# Altium project UWB-NODE.PrjPcb
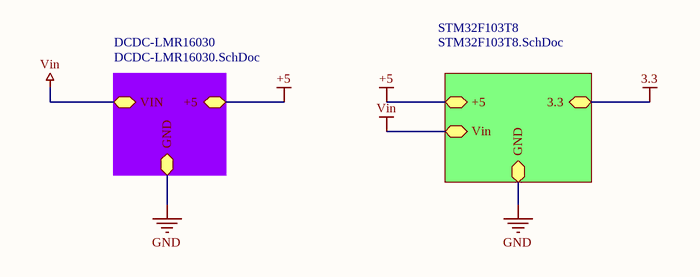
[diagram p0: UWB-NODE.SchDoc]
Quantity: 10
2 sheets, 32 parts. Net scope: hierarchical (ports join the sheet entries above them; power ports are global).
Board file: UWB-NODE.PcbDoc
Sheets:
  UWB-NODE.SchDoc
    STM32F103T8 = STM32F103T8.SchDoc

## Sheet UWB-NODE.SchDoc
size A; SheetNumber: 1; SheetTotal: 3

### Sub-sheets
DCDC-LMR16030 = DCDC-LMR16030.SchDoc (file not in this document): GND (bidir), VIN (bidir), +5 (bidir)
STM32F103T8 = STM32F103T8.SchDoc: GND (bidir), +5 (bidir), 3.3 (bidir), Vin (bidir)

### Nets
+5: sheet DCDC-LMR16030/+5, sheet STM32F103T8/+5
GND: sheet DCDC-LMR16030/GND, sheet STM32F103T8/GND
Vin: sheet DCDC-LMR16030/VIN, sheet STM32F103T8/Vin

## Sheet STM32F103T8.SchDoc
size A2; Revision: 10; SheetNumber: 3; SheetTotal: 3
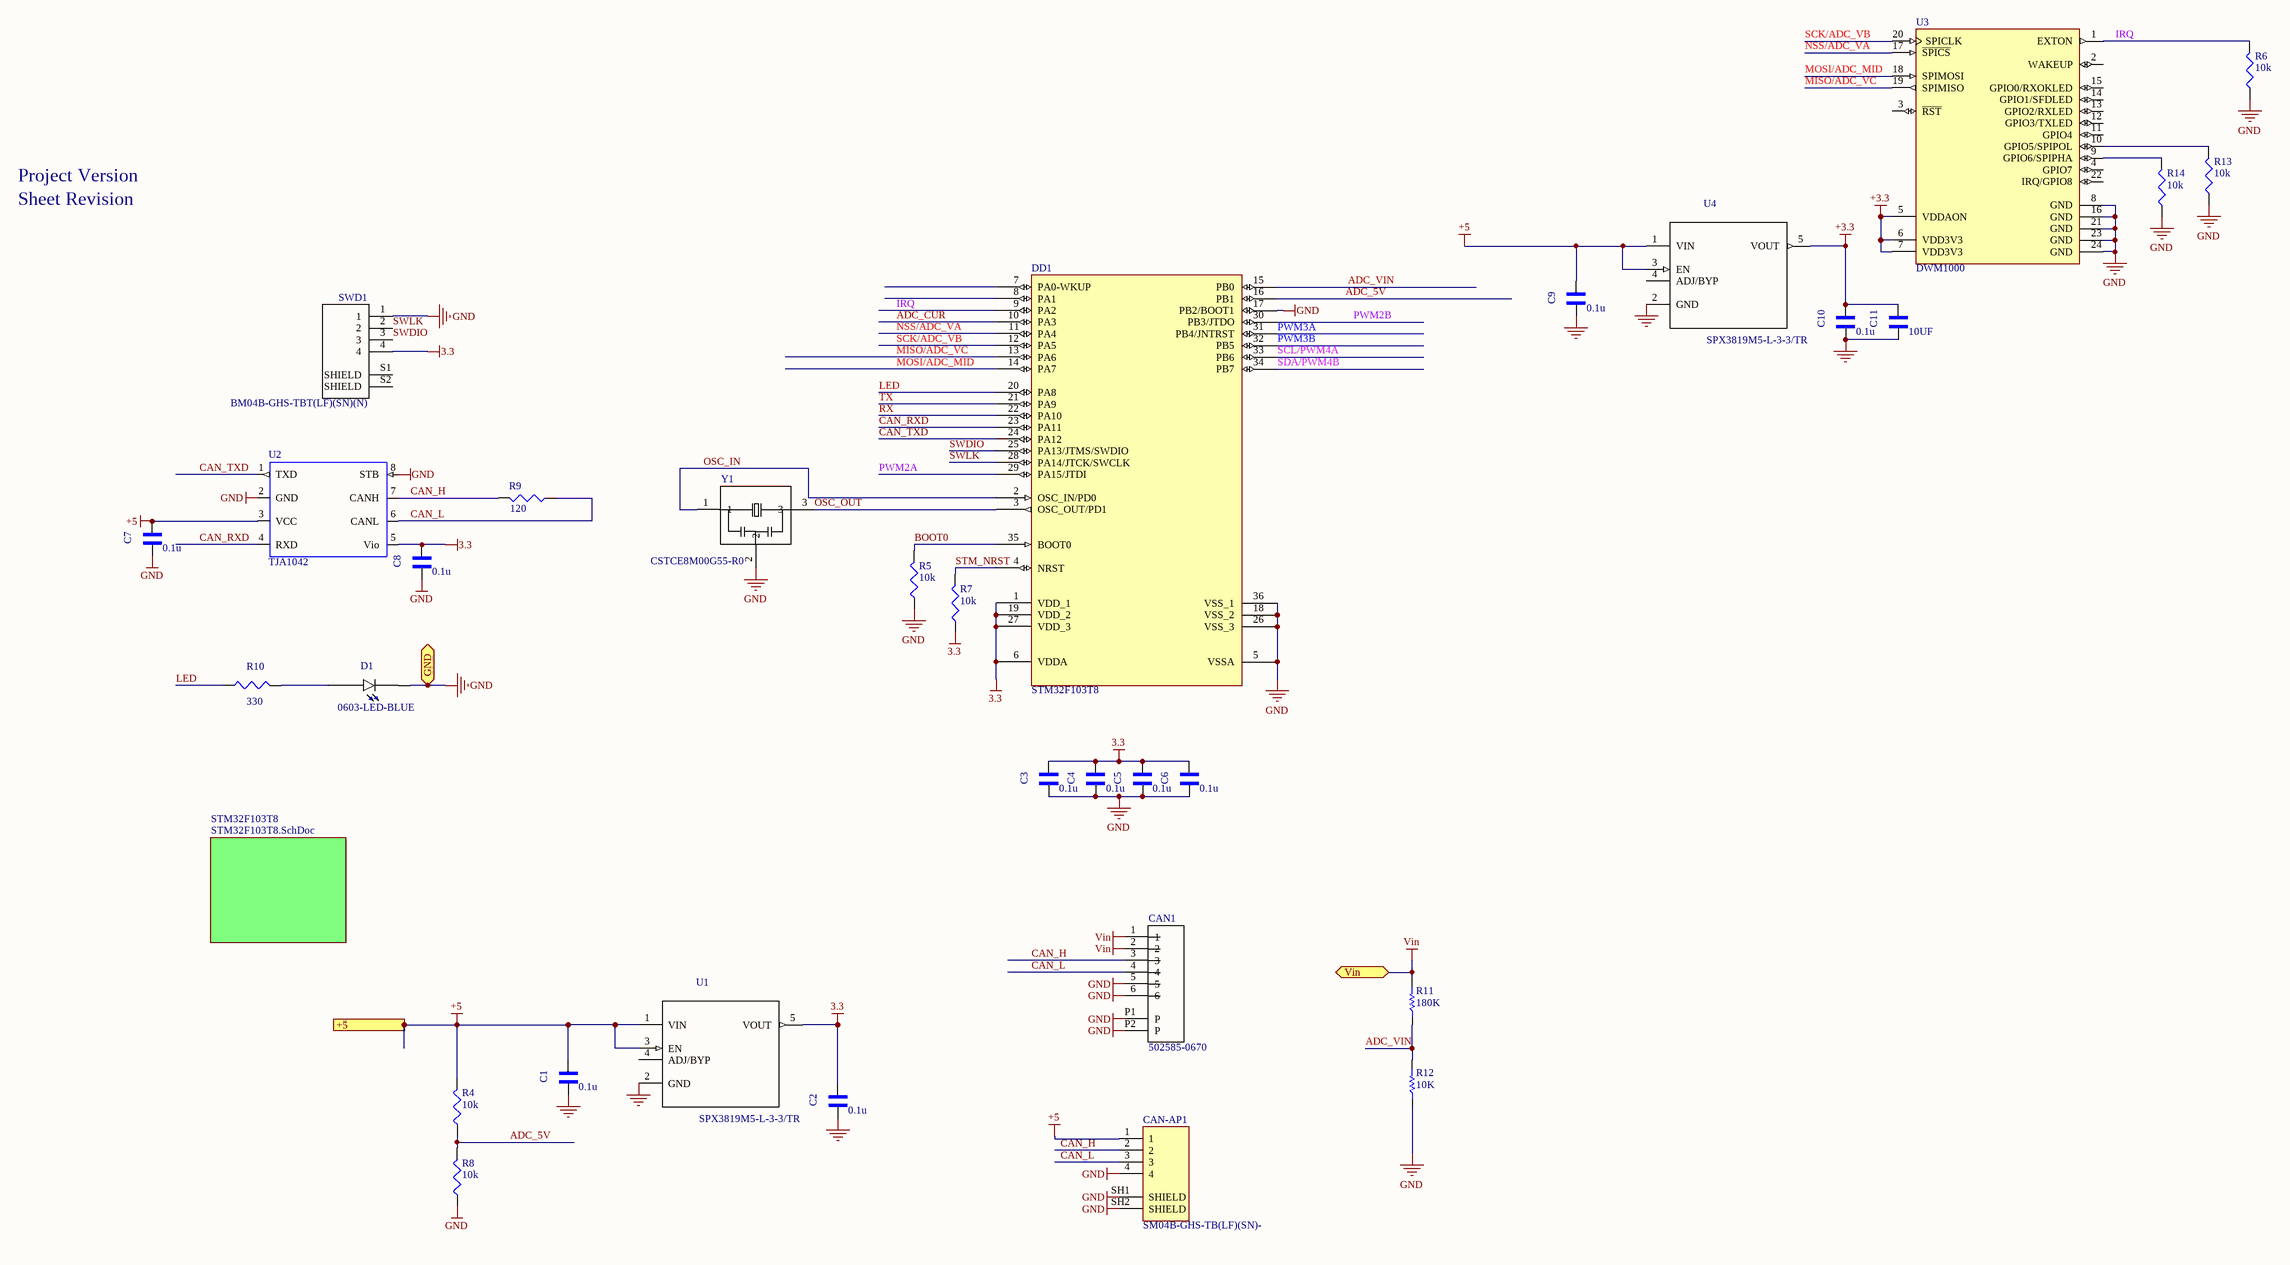
[diagram p1: STM32F103T8.SchDoc]

### Parts
C1  value 0.1u  [*CAPC1608X90]  (hidden comment: GX035C104MAT2-500)
C2  value 0.1u  [*CAPC1608X90]  (hidden comment: GX035C104MAT2-500)
C3  value 0.1u  [*CAPC1608X90]  (hidden comment: GX035C104MAT2-500)
C4  value 0.1u  [*CAPC1608X90]  (hidden comment: GX035C104MAT2-500)
C5  value 0.1u  [*CAPC1608X90]  (hidden comment: GX035C104MAT2-500)
C6  value 0.1u  [*CAPC1608X90]  (hidden comment: GX035C104MAT2-500)
C7  value 0.1u  [*CAPC1608X90]  (hidden comment: GX035C104MAT2-500)
C8  value 0.1u  [*CAPC1608X90]  (hidden comment: GX035C104MAT2-500)
C9  value 0.1u  [*CAPC1608X90]  (hidden comment: GX035C104MAT2-500)
C10  value 0.1u  [*CAPC1608X90]  (hidden comment: GX035C104MAT2-500)
C11  value 10UF  [*CAPC1608X90]  (hidden comment: GX035C104MAT2-500)
CAN1  502585-0670  [MOLEX_502585-0670]
CAN-AP1  SM04B-GHS-TB(LF)(SN)-  [JST_SM04B-GHS-TB(LF)(SN)-]
D1  0603-LED-BLUE  [*LEDM1608X80_LTE-C1906R-14(Primary)]
DD1  STM32F103T8  [*QFN50P600X600X100-37N]
R4  value 10k  [J1-0603]  (hidden comment: RC0603FR-0710KL)
R5  value 10k  [J1-0603]  (hidden comment: RC0603FR-0710KL)
R6  value 10k  [J1-0603]  (hidden comment: RC0603FR-0710KL)
R7  value 10k  [J1-0603]  (hidden comment: RC0603FR-0710KL)
R8  value 10k  [J1-0603]  (hidden comment: RC0603FR-0710KL)
R9  value 120  [J1-0603]  (hidden comment: Res3)
R10  value 330  [J1-0603]  (hidden comment: Res3)
R11  180K  [RES 0603 (1608X06L)]
R12  10K  [RES 0603 (1608X06L)]
R13  value 10k  [J1-0603]  (hidden comment: RC0603FR-0710KL)
R14  value 10k  [J1-0603]  (hidden comment: RC0603FR-0710KL)
SWD1  BM04B-GHS-TBT(LF)(SN)(N)  [JST_BM04B-GHS-holes]
U1  SPX3819M5-L-3-3/TR  [*SOT95P280X145-5N]
U2  TJA1042  [SOT782-1]
U3  DWM1000  [DECW-DWM1000-24_V]
U4  SPX3819M5-L-3-3/TR  [*SOT95P280X145-5N]
Y1  CSTCE8M00G55-R0  [*OSC_CSTCE8M00G55-R0]

### Sub-sheets
STM32F103T8 = STM32F103T8.SchDoc: no entries

### Ports
+5 (in), GND (bidir), Vin (bidir)

### Nets
3.3: C2.1 C3.1 C4.1 C5.1 C6.1 C8.1 DD1.1(VDD_1) DD1.6(VDDA) DD1.19(VDD_2) DD1.27(VDD_3) R7.1 SWD1.4 U1.5(VOUT) U2.5(Vio)
+3.3: C10.1 C11.1 U3.5(VDDAON) U3.6(VDD3V3) U3.7(VDD3V3) U4.5(VOUT)
+5: C1.1 C7.1 C9.1 CAN-AP1.1 R4.2 U1.1(VIN) U1.3(EN) U2.3(VCC) U4.1(VIN) U4.3(EN) ; port +5
GND: C1.2 C2.2 C3.2 C4.2 C5.2 C6.2 C7.2 C8.2 C9.2 C10.2 C11.2 CAN1.5 CAN1.6 CAN1.P1(P) CAN1.P2(P) CAN-AP1.4 CAN-AP1.SH1(SHIELD) CAN-AP1.SH2(SHIELD) D1.C DD1.5(VSSA) DD1.17(PB2/BOOT1) DD1.18(VSS_2) DD1.26(VSS_3) DD1.36(VSS_1) R5.1 R6.1 R8.1 R12.1 R13.1 R14.1 SWD1.1 U1.2(GND) U2.2(GND) U2.8(STB) U3.8(GND) U3.16(GND) U3.21(GND) U3.23(GND) U3.24(GND) U4.2(GND) Y1.2 ; port GND
Vin: CAN1.1 CAN1.2 R11.2 ; port Vin
ADC_5V: DD1.16(PB1) R4.1 R8.2
ADC_CUR: DD1.10(PA3)
ADC_VIN: DD1.15(PB0) R11.1 R12.2
BOOT0: DD1.35(BOOT0) R5.2
CAN_H: CAN1.3 CAN-AP1.2 R9.2 U2.7(CANH)
CAN_L: CAN1.4 CAN-AP1.3 R9.1 U2.6(CANL)
CAN_RXD: DD1.23(PA11) U2.4(RXD)
CAN_TXD: DD1.24(PA12) U2.1(TXD)
IRQ: DD1.9(PA2) R6.2 U3.1(EXTON)
LED: DD1.20(PA8) R10.1
MISO/ADC_VC: DD1.13(PA6) U3.19(SPIMISO)
MOSI/ADC_MID: DD1.14(PA7) U3.18(SPIMOSI)
NSS/ADC_VA: DD1.11(PA4) U3.17(~{SPICS})
OSC_IN: DD1.2(OSC_IN/PD0) Y1.1
OSC_OUT: DD1.3(OSC_OUT/PD1) Y1.3
PWM2A: DD1.29(PA15/JTDI)
PWM2B: DD1.30(PB3/JTDO)
PWM3A: DD1.31(PB4/JNTRST)
PWM3B: DD1.32(PB5)
RX: DD1.22(PA10)
SCK/ADC_VB: DD1.12(PA5) U3.20(SPICLK)
SCL/PWM4A: DD1.33(PB6)
SDA/PWM4B: DD1.34(PB7)
STM_NRST: DD1.4(NRST) R7.2
SWDIO: DD1.25(PA13/JTMS/SWDIO) SWD1.3
SWLK: DD1.28(PA14/JTCK/SWCLK) SWD1.2
TX: DD1.21(PA9)
NetD1_A: D1.A R10.2
NetR13_2: R13.2 U3.10(GPIO5/SPIPOL)
NetR14_2: R14.2 U3.9(GPIO6/SPIPHA)

Not connected (* = marked no-connect by the designer): DD1 7(PA0-WKUP) 8(PA1); SWD1 S1(SHIELD) S2(SHIELD); U1 4(ADJ/BYP); U3 2(WAKEUP) 3(~{RST}) 4(GPIO7) 11(GPIO4) 12(GPIO3/TXLED) 13(GPIO2/RXLED) 14(GPIO1/SFDLED) 15(GPIO0/RXOKLED) 22(IRQ/GPIO8); U4 4(ADJ/BYP)

### Notes on the sheet
- Project Version
- Sheet Revision

### Library data of the parts
C1 C2 C9-C11 = GX035C104MAT2-500: Cap Thin Film 0.1uf 50v 0603; MF: AVX; Pacage Metric: 1608; Type: SMD; Package: 0603 AVX; MP: GX035C104MAT2-500; SnapEDA_Link: https://www.snapeda.com/parts/GX035C104MAT2-500/AVX/view-part/?ref=snap
  C11: ChipDip_Link: https://www.chipdip.ru/product0/8004208718
C3-C8 = GX035C104MAT2-500: Cap Thin Film 0.1uf 50v 0603; MF: AVX; MP: GX035C104MAT2-500 or CL10B104JB8NNNC; Pacage Metric: 1608; Type: SMD; Package: 0603 AVX; SnapEDA_Link: https://www.snapeda.com/parts/GX035C104MAT2-500/AVX/view-part/?ref=snap
CAN1 = 502585-0670: 1.50mm Pitch, CLIK-Mate PCB Receptacle, Single Row, Surface Mount, Right-Angle, Tin Plating, Positive Lock, 6 Circuits, Natural; MF: Molex; System: Connector; MP: 502585-0670; Package: None; SnapEDA_Link: https://www.snapeda.com/parts/502494-0670/Molex/view-part/?ref=snap; Value: *; Type: SMD
CAN-AP1 = SM04B-GHS-TB(LF)(SN)-: Connector Header Surface Mount, Right Angle 4 position 0.049 _1.25mm_; MF: JST Sales; MP: SM04B-GHS-TB(LF)(SN); Package: None; Value: *; SnapEDA_Link: https://www.snapeda.com/parts/SM04B-GHS-TB%28LF%29%28SN%29-/JST%20Sales%20America%20Inc./view-part/2759740/?ref=snap; HelpURL: http://www.farnell.com/datasheets/2082975.pdf; System: Connector; ChipDip_Link: https://www.chipdip.ru/product/sm04b-ghs-tb-lf-sn-gh-1.25mm-header-side-ent
D1 = LTE-C1906R-14: LED IrLED Chip LED 2-Pin SMD T/R; Package: 0603 Lite-On; MP: 0603-LED-BLUE; SnapEDA_Link: https://www.snapeda.com/parts/LTE-C1906R-14/Lite-On%20Inc./view-part/?ref=snap; Value: *; Type: SMD
DD1 = STM32F103T8: STM32F103T8U6, Микроконтроллер 32BIT ARM 64K FLASH [VFQFPN-36]; MF: STM; ChipDip_Link: https://www.chipdip.ru/product/stm32f103t8u6-2; HelpURL: http://www.st.com/stonline/products/literature/ds/13587.pdf; MP: STM32F103T8U6; Package: VFQFPN-36; SnapEDA_Link: https://www.snapeda.com/parts/STM32F103T8U6TR/STMicroelectronics/view-part/?ref=search&t=STM32F103T8U6; Type: SMD
R4-R8 R13 R14 = RC0603FR-0710KL: 10 kOhms 1 0.1 W 1 10 W Chip Resistor 0603 1608 Metric Thick Film; Pacage Metric: 1608; MF: Yageo or NXP; MP: 10K 1% 0603; ChipDip_Link: https://www.chipdip.ru/product0/9000079736; HelpURL: https://www.chipdip.ru/product0/9000079736; Package: R0603; Type: SMD; SnapEDA_Link: https://www.snapeda.com/parts/RC0603FR-0710KL/Yageo/view-part/?ref=dk&t=RC0603FR-0710KL&con_ref=None
R9 = Res3: 120 Ohms 1 0.1 W 1 10 W Chip Resistor 0603 1608 Metric Thick Film; Pacage Metric: 1608; MP: RC0603FR-07120RL; ChipDip_Link: https://www.chipdip.ru/product0/9000079618; HelpURL: https://www.chipdip.ru/product0/9000079618; Package: R0603; Type: SMD
R10 = Res3: Resistor; Pacage Metric: 1608; MP: RC0603FR-07330RL; ChipDip_Link: https://www.chipdip.ru/product0/9000079628; HelpURL: https://www.chipdip.ru/product0/9000079628; Package: R0603; Type: SMD
R11 R12 = Resistor: Tolerance: 5%; Power: 1/8 W
  R11: Value: 180K
  R12: Value: 10K
SWD1 = BM04B-GHS-TBT(LF)(SN)(N): Conn Shrouded Header HDR 4 POS 1.25mm Solder ST SMD Reel; MF: JST Sales; MP: SM04B-GHS-TB(LF)(SN); Instructions: Do not install; System: Connector; SnapEDA_Link: https://www.snapeda.com/parts/BM04B-GHS-TBT%28LF%29%28SN%29%28N%29/JST%20Sales%20America%20Inc./view-part/?ref=snap; Package: None; Value: *; Type: SMD
U1 U4 = SPX3819M5-L: Low Dropout Voltage Regulator, Adjustable 0.5A, В±1%, 2.5 to 16 Vin, 5-Pin SOT-23; MF: MaxLinear, Inc.; Value: 3V3; MP: SPX3819M5-L-3-3/TR; Package: SOT-23-5 Exar; SnapEDA_Link: https://www.snapeda.com/parts/SPX3819M5-L/MaxLinear%2C%20Inc./view-part/?ref=snap; Type: SMD; ChipDip_Link: https://www.chipdip.ru/product1/8003455237; HelpURL: http://www.farnell.com/datasheets/2614478.pdf
U2 = TJA1042: 1/1 Transceiver Half CANbus 8-SO; MF: NXP USA; SnapEDA_Link: https://www.snapeda.com/parts/TJA1042/NXP%20USA%20Inc./view-part/900919/?ref=snap; Value: *; MP: TJA1042; Package: VDFN-8 NXP USA; ChipDip_Link: https://www.chipdip.ru/product1/8002840332; HelpURL: https://static.chipdip.ru/lib/583/DOC001583059.pdf; Type: SMD
U3 = CMP-2000-05094-1: DW M1000 IEEE 802.15.4 -2011 UWB Transceiver Module; Manufacturer: Decawave; Voltage - Supply: 2.8V~3.6V; Protocol: IR-UWB; Featured Product: ScenSorDWM1000Module; Design Resources: DevelopmentToolSelector; Frequency: 3.5GHz~6.5GHz; Antenna Type: Integrated,Chip; Other Names: 1479-1002-2RUPF-G001A; Current - Receiving: 64mA; Data Rate: 6.8Mbps; Serial Interfaces: SPI; Current - Transmitting: 31mA; Modulation: BPM,BPSK; Standard Package: 500; Series: -; RF Family/Standard: 802.15.4; Operating Temperature: -40degC~85degC; Sensitivity: -; Packaging: Tape&Reel(TR); Datasheet Version: Rev. V1.0, 12/2015; Power - Output: -; Family: RFTransceiverModules; Memory Size: -; Package / Case: Module; Mounting Type: SurfaceMount; Datasheet URL: http://www.decawave.com/sites/default/files/resources/dwm1000-datasheet-v1.3.pdf; Online Catalog: ScenSorDWM1000Module; Category: RF/IFandRFID; Manufacturer URL: http://www.decawave.com/
Y1 = CSTCE8M00G55-R0: Ceramic Resonator 8MHz ??0.5% _Tol_ ??0.2% _Stability_ 33pF 40Ohm 3-Pin CSMD T/R; MF: Murata; MP: CSTCE8M00G55-R0; Package: SMD-3 Murata; SnapEDA_Link: https://www.snapeda.com/parts/CSTCE8M00G55-R0/Murata%20Electronics%20North%20America/view-part/?ref=snap; Value: *; ChipDip_Link: https://www.chipdip.ru/product1/8001783721; HelpURL: https://www.murata.com/en-eu/api/pdfdownloadapi?cate=&partno=CSTCE8M00G55-R0; Type: SMD